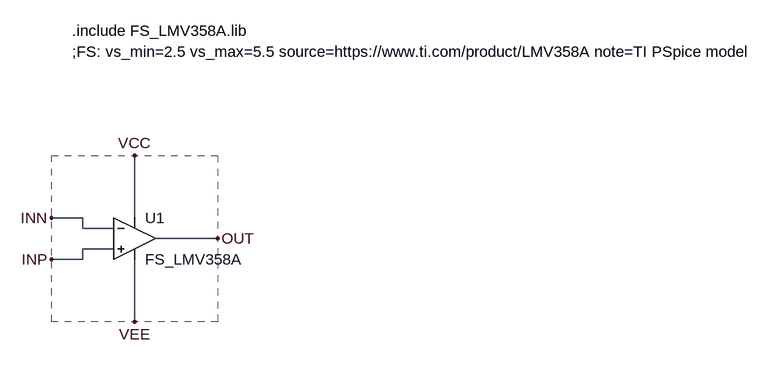
[diagram p0: schematic LMV358A.asc]
LMV358A.asc, the LTspice schematic file:
Version 4.1
SHEET 1 2928 560
WIRE 176 224 128 224
WIRE 256 224 256 128
WIRE 176 240 176 224
WIRE 224 240 176 240
WIRE 384 256 288 256
WIRE 224 272 176 272
WIRE 176 288 176 272
WIRE 176 288 128 288
WIRE 256 384 256 288
FLAG 128 224 INN
FLAG 128 288 INP
FLAG 384 256 OUT
FLAG 256 128 VCC
FLAG 256 384 VEE
SYMBOL OpAmps\\opamp2 256 192 R0
SYMATTR InstName U1
SYMATTR Value FS_LMV358A
TEXT 160 -64 Left 2 !.include FS_LMV358A.lib
TEXT 160 -32 Left 2 !;FS: vs_min=2.5 vs_max=5.5 source=https://www.ti.com/product/LMV358A note=TI PSpice model
RECTANGLE Normal 128 128 384 384 2

The netlist it stands for:
* LMV358A.asc
X§U1 INP INN VCC VEE OUT FS_LMV358A  ; pins In+ In- V+ V- OUT
.include FS_LMV358A.lib
;FS: vs_min=2.5 vs_max=5.5 source=https://www.ti.com/product/LMV358A note=TI PSpice model
.backanno
.end